# Altium schematic sheet Power.SchDoc
size B; SheetNumber: 3; SheetTotal: 5
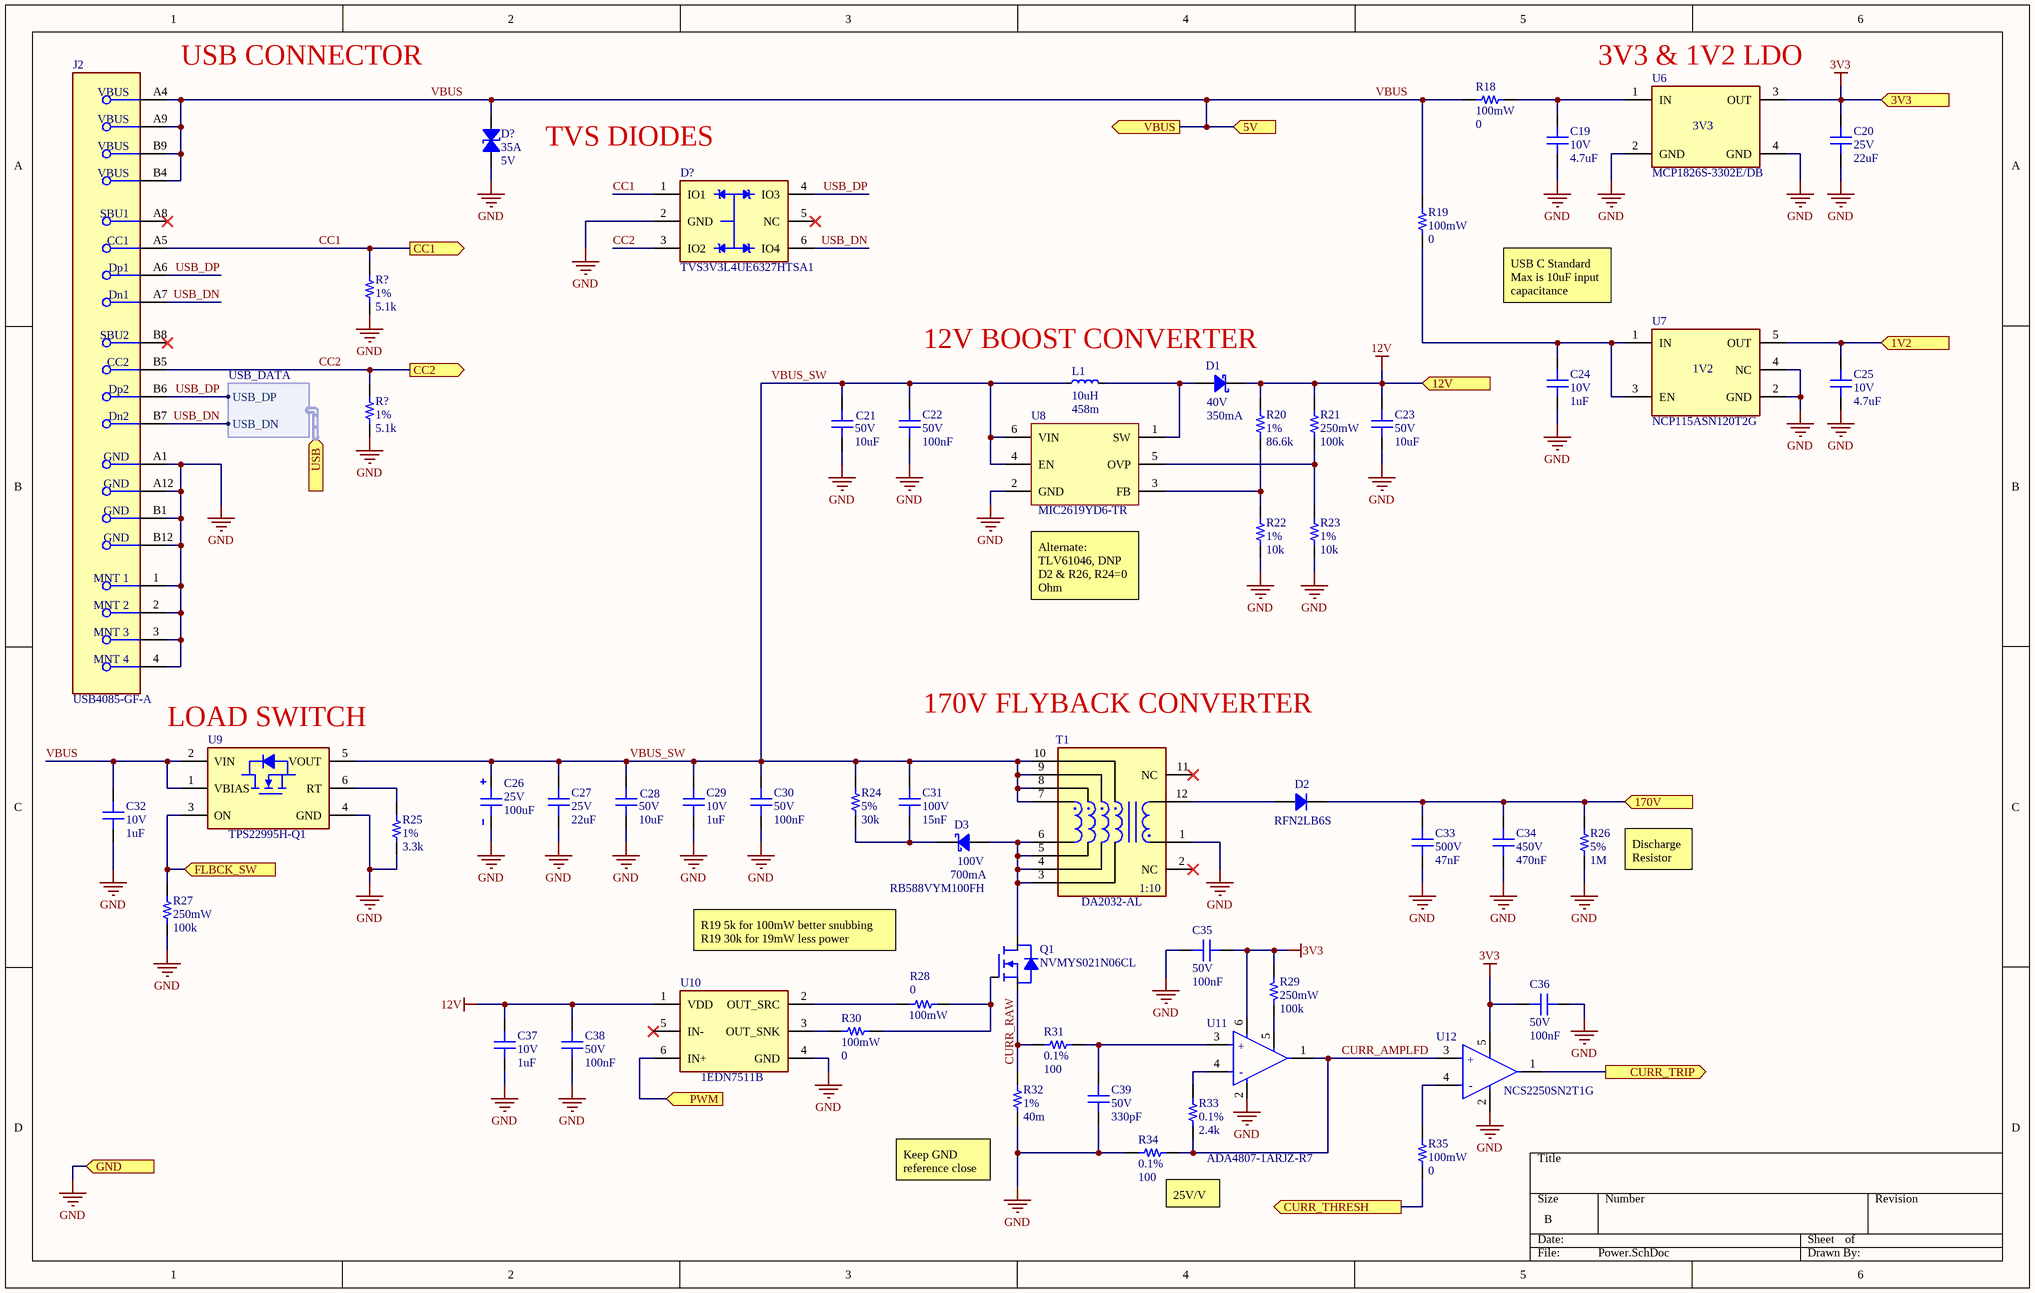
[diagram p0: Power.SchDoc]

## Parts
(Parts that share a designator on the sheet are numbered #1, #2 ... from top to bottom, then left to right.)
C19  Voltage Rating: 10V  Capacitance: 4.7uF  [0603]  (hidden comment: CL10A475KP8NNNC)
C20  Voltage Rating: 25V  Capacitance: 22uF  [0805]  (hidden comment: GRM21BR61E226ME44K)
C21  Voltage Rating: 50V  Capacitance: 10uF  [0805]  (hidden comment: GRM21BR61H106KE43L)
C22  Voltage Rating: 50V  Capacitance: 100nF  [0603]  (hidden comment: MT18B104K500CT)
C23  Voltage Rating: 50V  Capacitance: 10uF  [0805]  (hidden comment: GRM21BR61H106KE43L)
C24  Voltage Rating: 10V  Capacitance: 1uF  [0603]  (hidden comment: CL10B105KP8NFNC)
C25  Voltage Rating: 10V  Capacitance: 4.7uF  [0603]  (hidden comment: CL10A475KP8NNNC)
C26  Voltage Rating: 25V  Capacitance: 100uF  [0608]  (hidden comment: EHBSA025M1010608T)
C27  Voltage Rating: 25V  Capacitance: 22uF  [0805]  (hidden comment: GRM21BR61E226ME44K)
C28  Voltage Rating: 50V  Capacitance: 10uF  [0805]  (hidden comment: GRM21BR61H106KE43L)
C29  Voltage Rating: 10V  Capacitance: 1uF  [0603]  (hidden comment: CL10B105KP8NFNC)
C30  Voltage Rating: 50V  Capacitance: 100nF  [0603]  (hidden comment: MT18B104K500CT)
C31  Voltage Rating: 100V  Capacitance: 15nF  [0805]  (hidden comment: GRM2165C2A153JA01D)
C32  Voltage Rating: 10V  Capacitance: 1uF  [0603]  (hidden comment: CL10B105KP8NFNC)
C33  Voltage Rating: 500V  Capacitance: 47nF  [1206]  (hidden comment: VJ1206Y473KXEAT5Z)
C34  Voltage Rating: 450V  Capacitance: 470nF  [15mm Film Capacitor]  (hidden comment: ECW-FD2W474K)
C35  Voltage Rating: 50V  Capacitance: 100nF  [0603]  (hidden comment: MT18B104K500CT)
C36  Voltage Rating: 50V  Capacitance: 100nF  [0603]  (hidden comment: MT18B104K500CT)
C37  Voltage Rating: 10V  Capacitance: 1uF  [0603]  (hidden comment: CL10B105KP8NFNC)
C38  Voltage Rating: 50V  Capacitance: 100nF  [0603]  (hidden comment: MT18B104K500CT)
C39  Voltage Rating: 50V  Capacitance: 330pF  [0603]  (hidden comment: VJ0603A331FXACW1BC)
D1  Reverse Voltage: 40V  Average Current: 350mA  [SOD-323]  (hidden comment: SD103AWS-G3-08)
D2  RFN2LB6S  [DO-214AA]
D3  RB588VYM100FH  Reverse Voltage: 100V  Average Current: 700mA  [SOD-323HE]
D?#1  Peak Current: 35A  VWM: 5V  [SOD-323]  (hidden comment: STS321050B331AH)
D?#2  TVS3V3L4UE6327HTSA1  [SOT-23-6]
J2  USB4085-GF-A  [FP-USB4085-GF-A-MFG]
L1  Resistance: 458m  Inductance: 10uH  [SD3114 Series]  (hidden comment: SD3114-100-R)
Q1  NVMYS021N06CL  [LFPAK-4]
R18  Power Rating: 100mW  Resistance: 0  [0603]  (hidden comment: RC0603JR-070RL)
R19  Power Rating: 100mW  Resistance: 0  [0603]  (hidden comment: RC0603JR-070RL)
R20  Tolerance: 1%  Resistance: 86.6k  [0603]  (hidden comment: CRCW060386K6FKEA)
R21  Power Rating: 250mW  Resistance: 100k  [0603]  (hidden comment: CRGP0603F100K)
R22  Tolerance: 1%  Resistance: 10k  [0603]  (hidden comment: CRG0603F10K)
R23  Tolerance: 1%  Resistance: 10k  [0603]  (hidden comment: CRG0603F10K)
R24  Tolerance: 5%  Resistance: 30k  [1206]  (hidden comment: ERJ-P08J303V)
R25  Tolerance: 1%  Resistance: 3.3k  [0603]  (hidden comment: CRGCQ0603F3K3)
R26  Tolerance: 5%  Resistance: 1M  [1206]  (hidden comment: CRG1206F1M0)
R27  Power Rating: 250mW  Resistance: 100k  [0603]  (hidden comment: CRGP0603F100K)
R28  Power Rating: 100mW  Resistance: 0  [0603]  (hidden comment: RC0603JR-070RL)
R29  Power Rating: 250mW  Resistance: 100k  [0603]  (hidden comment: CRGP0603F100K)
R30  Power Rating: 100mW  Resistance: 0  [0603]  (hidden comment: RC0603JR-070RL)
R31  Tolerance: 0.1%  Resistance: 100  [0603]  (hidden comment: CPF0603B100RE1)
R32  Tolerance: 1%  Resistance: 40m  [1206]  (hidden comment: TLRP2B10WR040FTD)
R33  Tolerance: 0.1%  Resistance: 2.4k  [0603]  (hidden comment: CPF0603B2K4E1)
R34  Tolerance: 0.1%  Resistance: 100  [0603]  (hidden comment: CPF0603B100RE1)
R35  Power Rating: 100mW  Resistance: 0  [0603]  (hidden comment: RC0603JR-070RL)
R?#1  Tolerance: 1%  Resistance: 5.1k  [0805]  (hidden comment: CRG0805F5K1)
R?#2  Tolerance: 1%  Resistance: 5.1k  [0805]  (hidden comment: CRG0805F5K1)
T1  DA2032-AL  [DA2032-AL]
U6  MCP1826S-3302E/DB  [SOT-223-3]
U7  NCP115ASN120T2G  [SOT-23-5]
U8  MIC2619YD6-TR  [SOT-23-6]
U9  TPS22995H-Q1  [SOT-23-6]
U10  1EDN7511B  [SOT-23-6]
U11  ADA4807-1ARJZ-R7  [SOT-23-6]
U12  NCS2250SN2T1G  [SOT-23-5]

## Ports
1V2 (in, see Top Sheet[2C], FPGA[6A]), 3V3 (in, see Top Sheet[2C], FPGA[6A], Nixie[1A]), 5V (in, see Top Sheet[3B], MCU[5C]), 12V (in, see Top Sheet[3B], MCU[5C]), 170V (in, see Top Sheet[3B], MCU[5C]), CC1 (out, see Top Sheet[2A], FPGA[5C]), CC2 (out, see Top Sheet[2B], FPGA[5D]), CURR_THRESH (out, see Top Sheet[2B], FPGA[3A]), CURR_TRIP (out, see Top Sheet[2B], FPGA[3B]), FLBCK_SW (in, see Top Sheet[2B], FPGA[3A]), GND (in, see Top Sheet[2C], FPGA[6A], Nixie[1A]), PWM (in, see Top Sheet[2B], FPGA[3B]), USB (in, harness USB_DATA, see Top Sheet[3C], MCU[3A]), VBUS (out, see Top Sheet[2B], FPGA[5C])

## Harnesses
USB_DATA: USB_DP, USB_DN

## Nets
3V3: C20.2 C35.1 C36.1 R29.2 U6.3(OUT) U11.6(V+) U12.5(VDD) ; port 3V3
12V: C23.2 C37.2 C38.1 D1.1(Cathode) R20.2 R21.2 U10.1(VDD) ; port 12V
GND: C19.1 C20.1 C21.1 C22.2 C23.1 C24.1 C25.1 C26.1 C27.1 C28.1 C29.1 C30.2 C32.1 C33.1 C34.1 C35.2 C36.2 C37.1 C38.2 C39.1 D?#1.1 D?#2.2(GND) J2.1(MNT_1) J2.2(MNT_2) J2.3(MNT_3) J2.4(MNT_4) J2.A1(GND) J2.A12(GND) J2.B1(GND) J2.B12(GND) R22.1 R23.1 R25.1 R26.1 R27.1 R32.1 R34.1 R?#1.1 R?#2.1 T1.1 U6.2(GND) U6.4(GND) U7.2(GND) U7.4(NC) U8.2(GND) U9.4(GND) U10.4(GND) U11.2(VS-) U12.2(VSS) ; port GND
1V2: C25.2 U7.5(OUT) ; port 1V2
170V: C33.2 C34.2 D2.1(Cathode) R26.2 ; port 170V
CC1: D?#2.1(IO1) J2.A5(CC1) R?#1.2 ; port CC1
CC2: D?#2.3(IO2) J2.B5(CC2) R?#2.2 ; port CC2
CURR_AMPLFD: R33.1 R34.2 U11.1(OUT1) U12.3(IN1+)
CURR_RAW: Q1.1(S) R31.1 R32.2
CURR_THRESH: R35.1 ; port CURR_THRESH
CURR_TRIP: U12.1(OUT1) ; port CURR_TRIP
FLBCK_SW: R27.2 U9.3(ON) ; port FLBCK_SW
PWM: U10.6(IN+) ; port PWM
USB_DN: D?#2.6(IO4) J2.A7(Dn1) J2.B7(Dn2) ; port USB.USB_DN
USB_DP: D?#2.4(IO3) J2.A6(Dp1) J2.B6(Dp2) ; port USB.USB_DP
VBUS: C32.2 D?#1.2 J2.A4(VBUS) J2.A9(VBUS) J2.B4(VBUS) J2.B9(VBUS) R18.2 R19.2 U9.1(VBIAS) U9.2(VIN) ; port 5V, port VBUS
VBUS_SW: C21.2 C22.1 C26.2 C27.2 C28.2 C29.2 C30.1 C31.2 L1.1 R24.2 T1.7 T1.8 T1.9 T1.10 U8.4(EN) U8.6(VIN) U9.5(VOUT)
NetC19_2: C19.2 R18.1 U6.1(IN)
NetC24_2: C24.2 R19.1 U7.1(IN) U7.3(EN)
NetC31_1: C31.1 D3.1(Cathode) R24.1
NetC39_2: C39.2 R31.2 U11.3(IN1+)
NetD1_2: D1.2(Anode) L1.2 U8.1(SW)
NetD2_2: D2.2(Anode) T1.12
NetD3_2: D3.2(Anode) Q1.5(D) T1.3 T1.4 T1.5 T1.6
NetQ1_4: Q1.4(G) R28.2 R30.2
NetR20_1: R20.1 R22.2 U8.3(FB)
NetR21_1: R21.1 R23.2 U8.5(OVP)
NetR25_2: R25.2 U9.6(RT)
NetR28_1: R28.1 U10.2(OUT_SRC)
NetR29_1: R29.1 U11.5(!DISABLE)
NetR30_1: R30.1 U10.3(OUT_SNK)
NetR33_2: R33.2 U11.4(IN1-)
NetR35_2: R35.2 U12.4(IN1-)

Not connected (* = marked no-connect by the designer): D?#2 5(NC)*; J2 A8(SBU1)* B8(SBU2)*; Q1 2(S) 3(S) 6(D) 7(D) 8(D); T1 2(NC)* 11(NC)*; U10 5(IN-)*

## Notes on the sheet
- (near J2) USB CONNECTOR
- (near U6) 3V3 & 1V2 LDO
- (near D?#2) TVS DIODES
- USB C Standard Max is 10uF input capacitance
- 12V BOOST CONVERTER
- (near U8) Alternate: TLV61046, DNP D2 & R26, R24=0 Ohm
- LOAD SWITCH
- (near T1) 170V FLYBACK CONVERTER
- (near R26) Discharge Resistor
- R19 5k for 100mW better snubbing
  R19 30k for 19mW less power
- (near R32) Keep GND reference close
- (near R34) 25V/V
- (in symbol ADA4807-1ARJZ-R7) +; -
- (in symbol DA2032-AL) 1:10
- (in symbol MCP1826S-3302E/DB) 3V3
- (in symbol NCP115ASN120T2G) 1V2
- (in symbol NCS2250SN2T1G) +; -

## Library data of the parts
C19 C25 = CL10A475KP8NNNC: 4.7 µF ±10% 10V Ceramic Capacitor X5R 0603 (1608 Metric); Dielectric: X5R; Tolerance: 10%
C20 C27 = GRM21BR61E226ME44K: 22 µF ±20% 25V Ceramic Capacitor X5R 0805 (2012 Metric); Dielectric: X5R; Tolerance: 20%
C21 C23 C28 = GRM21BR61H106KE43L: 10 µF ±10% 50V Ceramic Capacitor X5R 0805 (2012 Metric); Dielectric: X5R; Tolerance: 10%
C22 C30 C35 C36 C38 = MT18B104K500CT: 0.1 µF ±10% 50V Ceramic Capacitor X7R 0603 (1608 Metric); Dielectric: X7R; Tolerance: 10%
C24 C29 C32 C37 = CL10B105KP8NFNC: 1 µF ±10% 10V Ceramic Capacitor X7R 0603 (1608 Metric); Dielectric: X7R; Tolerance: 10%
C26 = EHBSA025M1010608T: 100 µF 25 V Aluminum - Polymer Capacitors Radial, Can - SMD 30mOhm 4000 Hrs @ 125°C; Dielectric: AOP; Tolerance: 20%
C31 = GRM2165C2A153JA01D: 0.015 µF ±5% 100V Ceramic Capacitor C0G, NP0 0805 (2012 Metric); Dielectric: C0G (NP0); Tolerance: 5%
C33 = VJ1206Y473KXEAT5Z: Multilayer Ceramic Capacitors MLCC - SMD/SMT 1206 .047uF 500volts X7R 10%; Dielectric: X7R; Tolerance: 10%
C34 = ECW-FD2W474K: 0.47 µF Film Capacitor 450V Polypropylene (PP), Metallized Radial; Tolerance: 10%; Dielectric: PP
C39 = VJ0603A331FXACW1BC: 330 pF ±1% 50V Ceramic Capacitor C0G, NP0 0603 (1608 Metric); Dielectric: C0G (NP0); Tolerance: 1%
D1 = SD103AWS-G3-08: Diode 40 V 350mA Surface Mount SOD-323; Type: Schottky; Package: SOD-323
D2 = RFN2LB6S: Diode 600 V 2A Surface Mount SMBP; Reverse Voltage: 600V; Type: Fast Recovery; Average Current: 2A; Package: DO-214AA
D3 = RB588VYM100FH: Diode 100 V 700mA Surface Mount TUMD2M (SOD-323HE); Type: Schottky; Package: SOD-323HE
D?#1 = STS321050B331AH: 14V Clamp 35A (8/20µs) Ipp Tvs Diode Surface Mount SOD-323; Package: SOD-323; Reverse Voltage: 14V; Type: TVS
D?#2 = TVS3V3L4UE6327HTSA1: 7.7V (Typ) Clamp 20A (8/20µs) Ipp Tvs Diode Surface Mount PG-SC74-6; VWM: 3.3V; Package: SOT-23-6; Reverse Voltage: 7.7 V; Type: TVS
J2 = USB4085-GF-A: USB-C USB 2.0 Receptacle
L1 = SD3114-100-R: 10 µH Shielded Drum Core, Wirewound Inductor 570 mA 458mOhm Nonstandard; Avg Current: 570mA; Sat Current: 780mA
Q1 = NVMYS021N06CL: N-Channel 60 V 9.8A (Ta), 27A (Tc) 3.8W (Ta), 28W (Tc) Surface Mount LFPAK4 (5x6)
R18 R19 R28 R30 R35 = RC0603JR-070RL: 0 Ohms Jumper 0.1W, 1/10W Chip Resistor 0603 (1608 Metric) Moisture Resistant Thick Film; Temperature Coefficient: 0ppm/c; Tolerance: 0%; Case Code: 0603
R20 = CRCW060386K6FKEA: 86.6 kOhms ±1% 0.125W, 1/8W Chip Resistor 0603 (1608 Metric) Automotive AEC-Q200 Thick Film; Power Rating: 125mW; Temperature Coefficient: 200ppm/c; Case Code: 0603
R21 R27 R29 = CRGP0603F100K: 100 kOhms ±1% 0.25W, 1/4W Chip Resistor 0603 (1608 Metric) Automotive AEC-Q200, Pulse Withstanding Thick Film; Temperature Coefficient: 100ppm/c; Case Code: 0603; Tolerance: 1%
R22 R23 = CRG0603F10K: 10 kOhms ±1% 0.1W, 1/10W Chip Resistor 0603 (1608 Metric) Thick Film; Power Rating: 100mW; Temperature Coefficient: 100ppm/c; Case Code: 0603
R24 = ERJ-P08J303V: 30 kOhms ±5% 0.667W, 2/3W Chip Resistor 1206 (3216 Metric) Automotive AEC-Q200, Pulse Withstanding Thick Film; Power Rating: 667mW; Temperature Coefficient: 200ppm/c; Case Code: 1206
R25 = CRGCQ0603F3K3: 3.3 kOhms ±1% 0.1W, 1/10W Chip Resistor 0603 (1608 Metric) Automotive AEC-Q200, Moisture Resistant Thick Film; Power Rating: 100mW; Temperature Coefficient: 100ppm/c; Case Code: 0603
R26 = CRG1206F1M0: 1 MOhms ±1% 0.25W, 1/4W Chip Resistor 1206 (3216 Metric) Thick Film; Power Rating: 250mW; Temperature Coefficient: 200ppm/c; Case Code: 1206
R31 R34 = CPF0603B100RE1: 100 Ohms ±0.1% 0.063W, 1/16W Chip Resistor 0603 (1608 Metric) Thin Film; Power Rating: 62.5mW; Temperature Coefficient: 25ppm/c; Case Code: 0603
R32 = TLRP2B10WR040FTD: 40 mOhms ±1% 1W Chip Resistor 1206 (3216 Metric) Anti-Sulfur, Automotive AEC-Q200, Current Sense Metal Element; Temperature Coefficient: 75ppm/c; Power Rating: 1W; Case Code: 1206
R33 = CPF0603B2K4E1: 2.4 kOhms ±0.1% 0.063W, 1/16W Chip Resistor 0603 (1608 Metric) Thin Film; Power Rating: 62.5mW; Temperature Coefficient: 25ppm/c; Case Code: 0603
R?#1 R?#2 = CRG0805F5K1: 5.1 kOhms ±1% 0.125W, 1/8W Chip Resistor 0805 (2012 Metric) Thick Film; Power Rating: 125mW; Temperature Coefficient: 100ppm/c; Case Code: 0805
T1 = DA2032-AL: 10 µH ±10% 1:10 Flyback Transformer Surface Mount Ferrite Core 3A Peak, 3–24V Input
U6 = MCP1826S-3302E/DB: Linear Voltage Regulator IC Positive Fixed 1 Output 1A SOT-223-3
U7 = NCP115ASN120T2G: Linear Voltage Regulator IC Positive Fixed 1 Output 300mA 5-TSOP
U8 = MIC2619YD6-TR: Boost Switching Regulator IC Positive Adjustable 2.8V 1 Output 350mA (Switch) SOT-23-6 Thin, TSOT-23-6
U9 = TPS22995H-Q1: Power Switch/Driver 1:1 N-Channel 3A SOT-23-THIN
U10 = 1EDN7511B: Low-Side Gate Driver IC Inverting, Non-Inverting PG-SOT23-6-2
U11 = ADA4807-1ARJZ-R7: Voltage Feedback Amplifier 1 Circuit Rail-to-Rail SOT-23-6
U12 = NCS2250SN2T1G: Comparator Standard (General Purpose) Push-Pull, Rail-to-Rail 5-TSOP